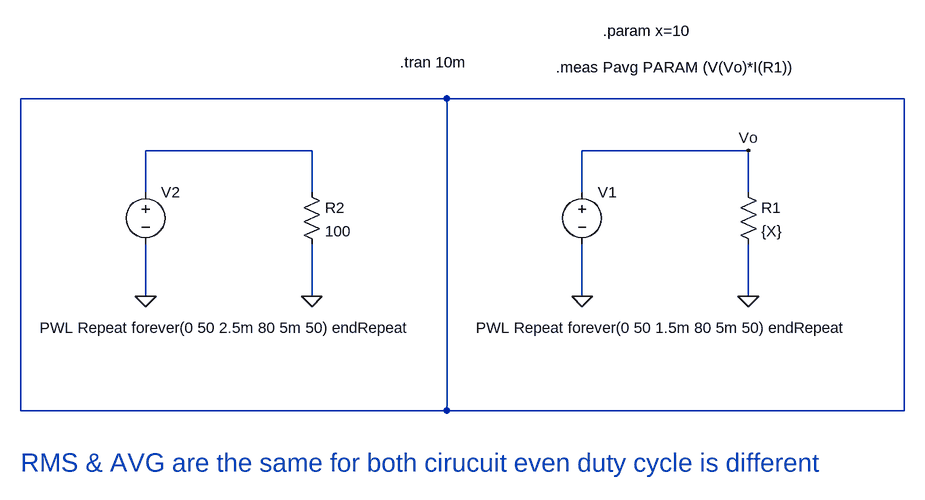
[diagram p0: schematic 02-avgAndRms.asc]
02-avgAndRms.asc, the LTspice schematic file:
Version 4
SHEET 1 880 680
WIRE -192 -32 -848 -32
WIRE 512 -32 -192 -32
WIRE -400 48 -656 48
WIRE 272 48 16 48
WIRE -656 112 -656 48
WIRE -400 112 -400 48
WIRE 16 112 16 48
WIRE 272 112 272 48
WIRE -656 272 -656 192
WIRE -400 272 -400 192
WIRE 16 272 16 192
WIRE 272 272 272 192
WIRE -848 448 -848 -32
WIRE -192 448 -192 -32
WIRE -192 448 -848 448
WIRE 512 448 512 -32
WIRE 512 448 -192 448
FLAG 16 272 0
FLAG 272 272 0
FLAG -656 272 0
FLAG -400 272 0
FLAG 272 48 Vo
SYMBOL res 256 96 R0
SYMATTR InstName R1
SYMATTR Value {X}
SYMBOL voltage 16 96 R0
WINDOW 3 -163 225 Left 2
SYMATTR Value PWL Repeat forever(0 50 1.5m 80 5m 50) endRepeat
SYMATTR InstName V1
SYMBOL res -416 96 R0
SYMATTR InstName R2
SYMATTR Value 100
SYMBOL voltage -656 96 R0
WINDOW 3 -163 225 Left 2
WINDOW 123 0 0 Left 0
WINDOW 39 0 0 Left 0
SYMATTR Value PWL Repeat forever(0 50 2.5m 80 5m 50) endRepeat
SYMATTR InstName V2
TEXT -264 -88 Left 2 !.tran 10m
TEXT -848 528 Left 4 ;RMS & AVG are the same for both cirucuit even duty cycle is different
TEXT -24 -80 Left 2 !.meas Pavg PARAM (V(Vo)*I(R1))
TEXT 48 -136 Left 2 !.param x=10

The netlist it stands for:
* 02-avgAndRms.asc
R1 Vo 0 {X}
V1 Vo 0 PWL Repeat forever(0 50 1.5m 80 5m 50) endRepeat
R2 N002 0 100
V2 N002 0 PWL Repeat forever(0 50 2.5m 80 5m 50) endRepeat
.tran 10m
* RMS & AVG are the same for both cirucuit even duty cycle is different
.meas Pavg PARAM (V(Vo)*I(R1))
.param x=10
.backanno
.end